# Altium schematic sheet gatedriver.SchDoc
size A4
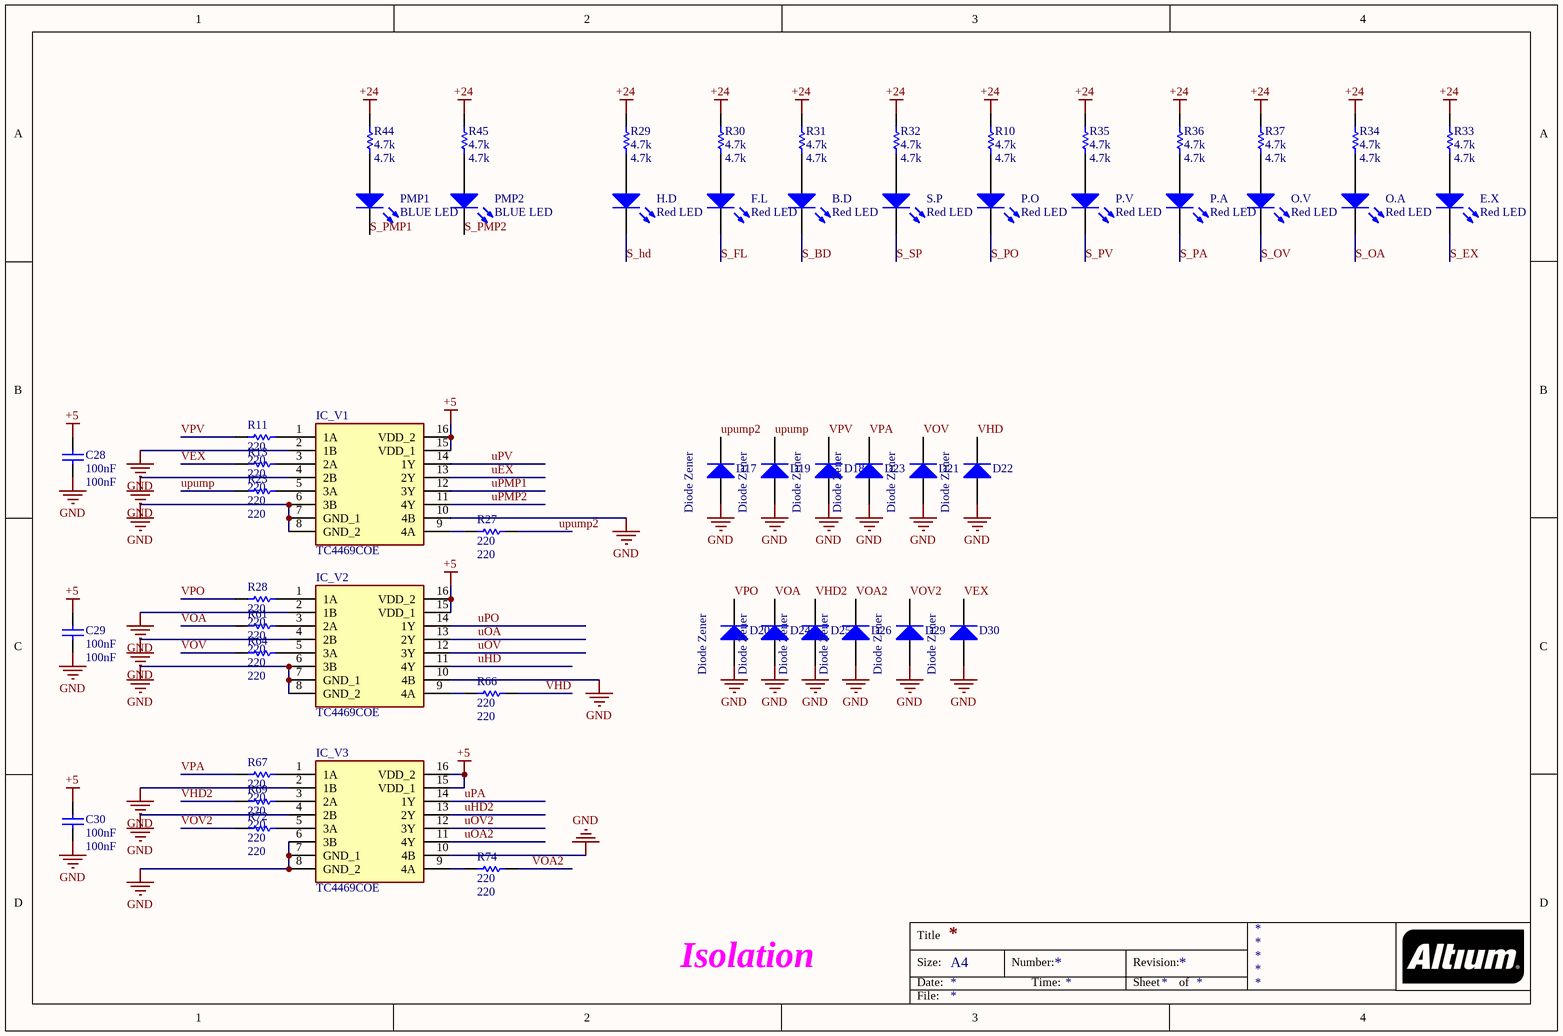
[diagram p0: gatedriver.SchDoc]

## Parts
B.D  Red LED  [3518]
C28  100nF  [0805]
C29  100nF  [0805]
C30  100nF  [0805]
D17  Diode Zener  [d1805]
D18  Diode Zener  [d1805]
D19  Diode Zener  [d1805]
D20  Diode Zener  [d1805]
D21  Diode Zener  [d1805]
D22  Diode Zener  [d1805]
D23  Diode Zener  [d1805]
D24  Diode Zener  [d1805]
D25  Diode Zener  [d1805]
D26  Diode Zener  [d1805]
D29  Diode Zener  [d1805]
D30  Diode Zener  [d1805]
E.X  Red LED  [3518]
F.L  Red LED  [3518]
H.D  Red LED  [3518]
IC_V1  TC4469COE  [SOIC127P1034X264-16N]
IC_V2  TC4469COE  [SOIC127P1034X264-16N]
IC_V3  TC4469COE  [SOIC127P1034X264-16N]
O.A  Red LED  [3518]
O.V  Red LED  [3518]
P.A  Red LED  [3518]
P.O  Red LED  [3518]
P.V  Red LED  [3518]
PMP1  BLUE LED  [3518]
PMP2  BLUE LED  [3518]
R10  4.7k  [0805]
R11  220  [0805]
R13  220  [0805]
R23  220  [0805]
R27  220  [0805]
R28  220  [0805]
R29  4.7k  [0805]
R30  4.7k  [0805]
R31  4.7k  [0805]
R32  4.7k  [0805]
R33  4.7k  [0805]
R34  4.7k  [0805]
R35  4.7k  [0805]
R36  4.7k  [0805]
R37  4.7k  [0805]
R44  4.7k  [0805]
R45  4.7k  [0805]
R61  220  [0805]
R64  220  [0805]
R66  220  [0805]
R67  220  [0805]
R69  220  [0805]
R72  220  [0805]
R74  220  [0805]
S.P  Red LED  [3518]

## Nets
+5: C28.2 C29.2 C30.2 IC_V1.15(VDD_1) IC_V1.16(VDD_2) IC_V2.15(VDD_1) IC_V2.16(VDD_2) IC_V3.15(VDD_1) IC_V3.16(VDD_2)
+24: R10.1 R29.1 R30.1 R31.1 R32.1 R33.1 R34.1 R35.1 R36.1 R37.1 R44.1 R45.1
GND: C28.1 C29.1 C30.1 D17.1(A) D18.1(A) D19.1(A) D20.1(A) D21.1(A) D22.1(A) D23.1(A) D24.1(A) D25.1(A) D26.1(A) D29.1(A) D30.1(A) IC_V1.2(1B) IC_V1.4(2B) IC_V1.6(3B) IC_V1.7(GND_1) IC_V1.8(GND_2) IC_V1.10(4B) IC_V2.2(1B) IC_V2.4(2B) IC_V2.6(3B) IC_V2.7(GND_1) IC_V2.8(GND_2) IC_V2.10(4B) IC_V3.2(1B) IC_V3.4(2B) IC_V3.6(3B) IC_V3.7(GND_1) IC_V3.8(GND_2) IC_V3.10(4B)
S_BD: B.D.2(K)
S_EX: E.X.2(K)
S_FL: F.L.2(K)
S_hd: H.D.2(K)
S_OA: O.A.2(K)
S_OV: O.V.2(K)
S_PA: P.A.2(K)
S_PMP1: PMP1.2(K)
S_PMP2: PMP2.2(K)
S_PO: P.O.2(K)
S_PV: P.V.2(K)
S_SP: S.P.2(K)
uEX: IC_V1.13(2Y)
uHD: IC_V2.11(4Y)
uHD2: IC_V3.13(2Y)
uOA: IC_V2.13(2Y)
uOA2: IC_V3.11(4Y)
uOV: IC_V2.12(3Y)
uOV2: IC_V3.12(3Y)
uPA: IC_V3.14(1Y)
uPMP1: IC_V1.12(3Y)
uPMP2: IC_V1.11(4Y)
uPO: IC_V2.14(1Y)
upump: D19.2(K) R23.2
upump2: D17.2(K) R27.2
uPV: IC_V1.14(1Y)
VEX: D30.2(K) R13.2
VHD: D22.2(K) R66.2
VHD2: D25.2(K) R69.2
VOA: D24.2(K) R61.2
VOA2: D26.2(K) R74.2
VOV: D21.2(K) R64.2
VOV2: D29.2(K) R72.2
VPA: D23.2(K) R67.1
VPO: D20.2(K) R28.1
VPV: D18.2(K) R11.1
NetB.D_1: B.D.1(A) R31.2
NetE.X_1: E.X.1(A) R33.2
NetF.L_1: F.L.1(A) R30.2
NetH.D_1: H.D.1(A) R29.2
NetIC_V1_1: IC_V1.1(1A) R11.2
NetIC_V1_3: IC_V1.3(2A) R13.1
NetIC_V1_5: IC_V1.5(3A) R23.1
NetIC_V1_9: IC_V1.9(4A) R27.1
NetIC_V2_1: IC_V2.1(1A) R28.2
NetIC_V2_3: IC_V2.3(2A) R61.1
NetIC_V2_5: IC_V2.5(3A) R64.1
NetIC_V2_9: IC_V2.9(4A) R66.1
NetIC_V3_1: IC_V3.1(1A) R67.2
NetIC_V3_3: IC_V3.3(2A) R69.1
NetIC_V3_5: IC_V3.5(3A) R72.1
NetIC_V3_9: IC_V3.9(4A) R74.1
NetO.A_1: O.A.1(A) R34.2
NetO.V_1: O.V.1(A) R37.2
NetP.A_1: P.A.1(A) R36.2
NetP.O_1: P.O.1(A) R10.2
NetP.V_1: P.V.1(A) R35.2
NetPMP1_1: PMP1.1(A) R44.2
NetPMP2_1: PMP2.1(A) R45.2
NetR32_2: R32.2 S.P.1(A)

## Notes on the sheet
- Isolation
- Title
- Size:
- Date:
- A4
- Number:
- Time:
- Revision:
- Sheet
- of
- File:

## Library data of the parts
B.D E.X F.L H.D O.A O.V P.A P.O P.V S.P = LED3: Typical BLUE SiC LED; pin to pad: 1>2 2>1; Published: 8-Jun-2000; LatestRevisionDate: 17-Dec-2003; LatestRevisionNote: PCB Footprint replaced.; DatasheetDocument: 16-Apr-2002; PackageDocument: 16-Apr-2002; PackageReference: 3.5X2.8X1.9; Publisher: Altium Limited
C28-C30 = Cap: Capacitor; Manufacturer: Generic Components; Class: Passive; Published: 08/06/2000; Publisher: Altium Hobart Technology Centre; SubClass: Capacitor; Value: 100nF
D17-D26 D29 D30 = Diode 1N914: High Conductance Fast Diode; Published: 8-Jun-2000; LatestRevisionDate: 17-Jul-2002; LatestRevisionNote: Re-released for DXP Platform.; DatasheetVersion: 1997; PackageReference: DO-35; Publisher: Altium Limited; PackageDescription: Diode, Axial; Body 3.8 x 1.9 mm (LxDia. max), Lead Dia. 0.53 mm (max); Code_JEDEC: DO-204-AH; ComponentLink1Description: Manufacturer Link; ComponentLink1URL: http://www.fairchildsemi.com/; ComponentLink2Description: Datasheet; ComponentLink2URL: http://www.fairchildsemi.com/ds/1N%2F1N4448.pdf
IC_V1-IC_V3 = TC4469COE: Integrated Circuit; Manufacturer_Name: Microchip; Datasheet Link: http://ww1.microchip.com/downloads/en/DeviceDoc/21425C.pdf; Height: 2.64mm; Manufacturer_Part_Number: TC4469COE; Mouser Part Number: 579-TC4469COE; Mouser Price/Stock: https://www.mouser.co.uk/ProductDetail/Microchip-Technology/TC4469COE?qs=InakTnyiSK%2Fh2FRrgfNERA%3D%3D; Arrow Part Number: TC4469COE; Arrow Price/Stock: https://www.arrow.com/en/products/tc4469coe/microchip-technology?region=nac
PMP1 PMP2 = LED3: pin to pad: 1>2 2>1; Published: 8-Jun-2000; LatestRevisionDate: 17-Dec-2003; LatestRevisionNote: PCB Footprint replaced.; DatasheetDocument: 16-Apr-2002; PackageDocument: 16-Apr-2002; PackageReference: 3.5X2.8X1.9; Publisher: Altium Limited
R10 R11 R13 R23 R27-R37 R44 R45 R61 R64 R66 R67 R69 R72 R74 = Res1: Resistor; Published: 8-Jun-2000; LatestRevisionDate: 17-Jul-2002; LatestRevisionNote: Re-released for DXP Platform.; PackageReference: AXIAL-0.3; Publisher: Altium Limited
  R10 R29-R37 R44 R45: Value: 4.7k
  R11 R13 R23 R27 R28 R61 R64 R66 R67 R69 R72 R74: Value: 220